# EAGLE schematic source_eagle (EAGLE 9.6.2)
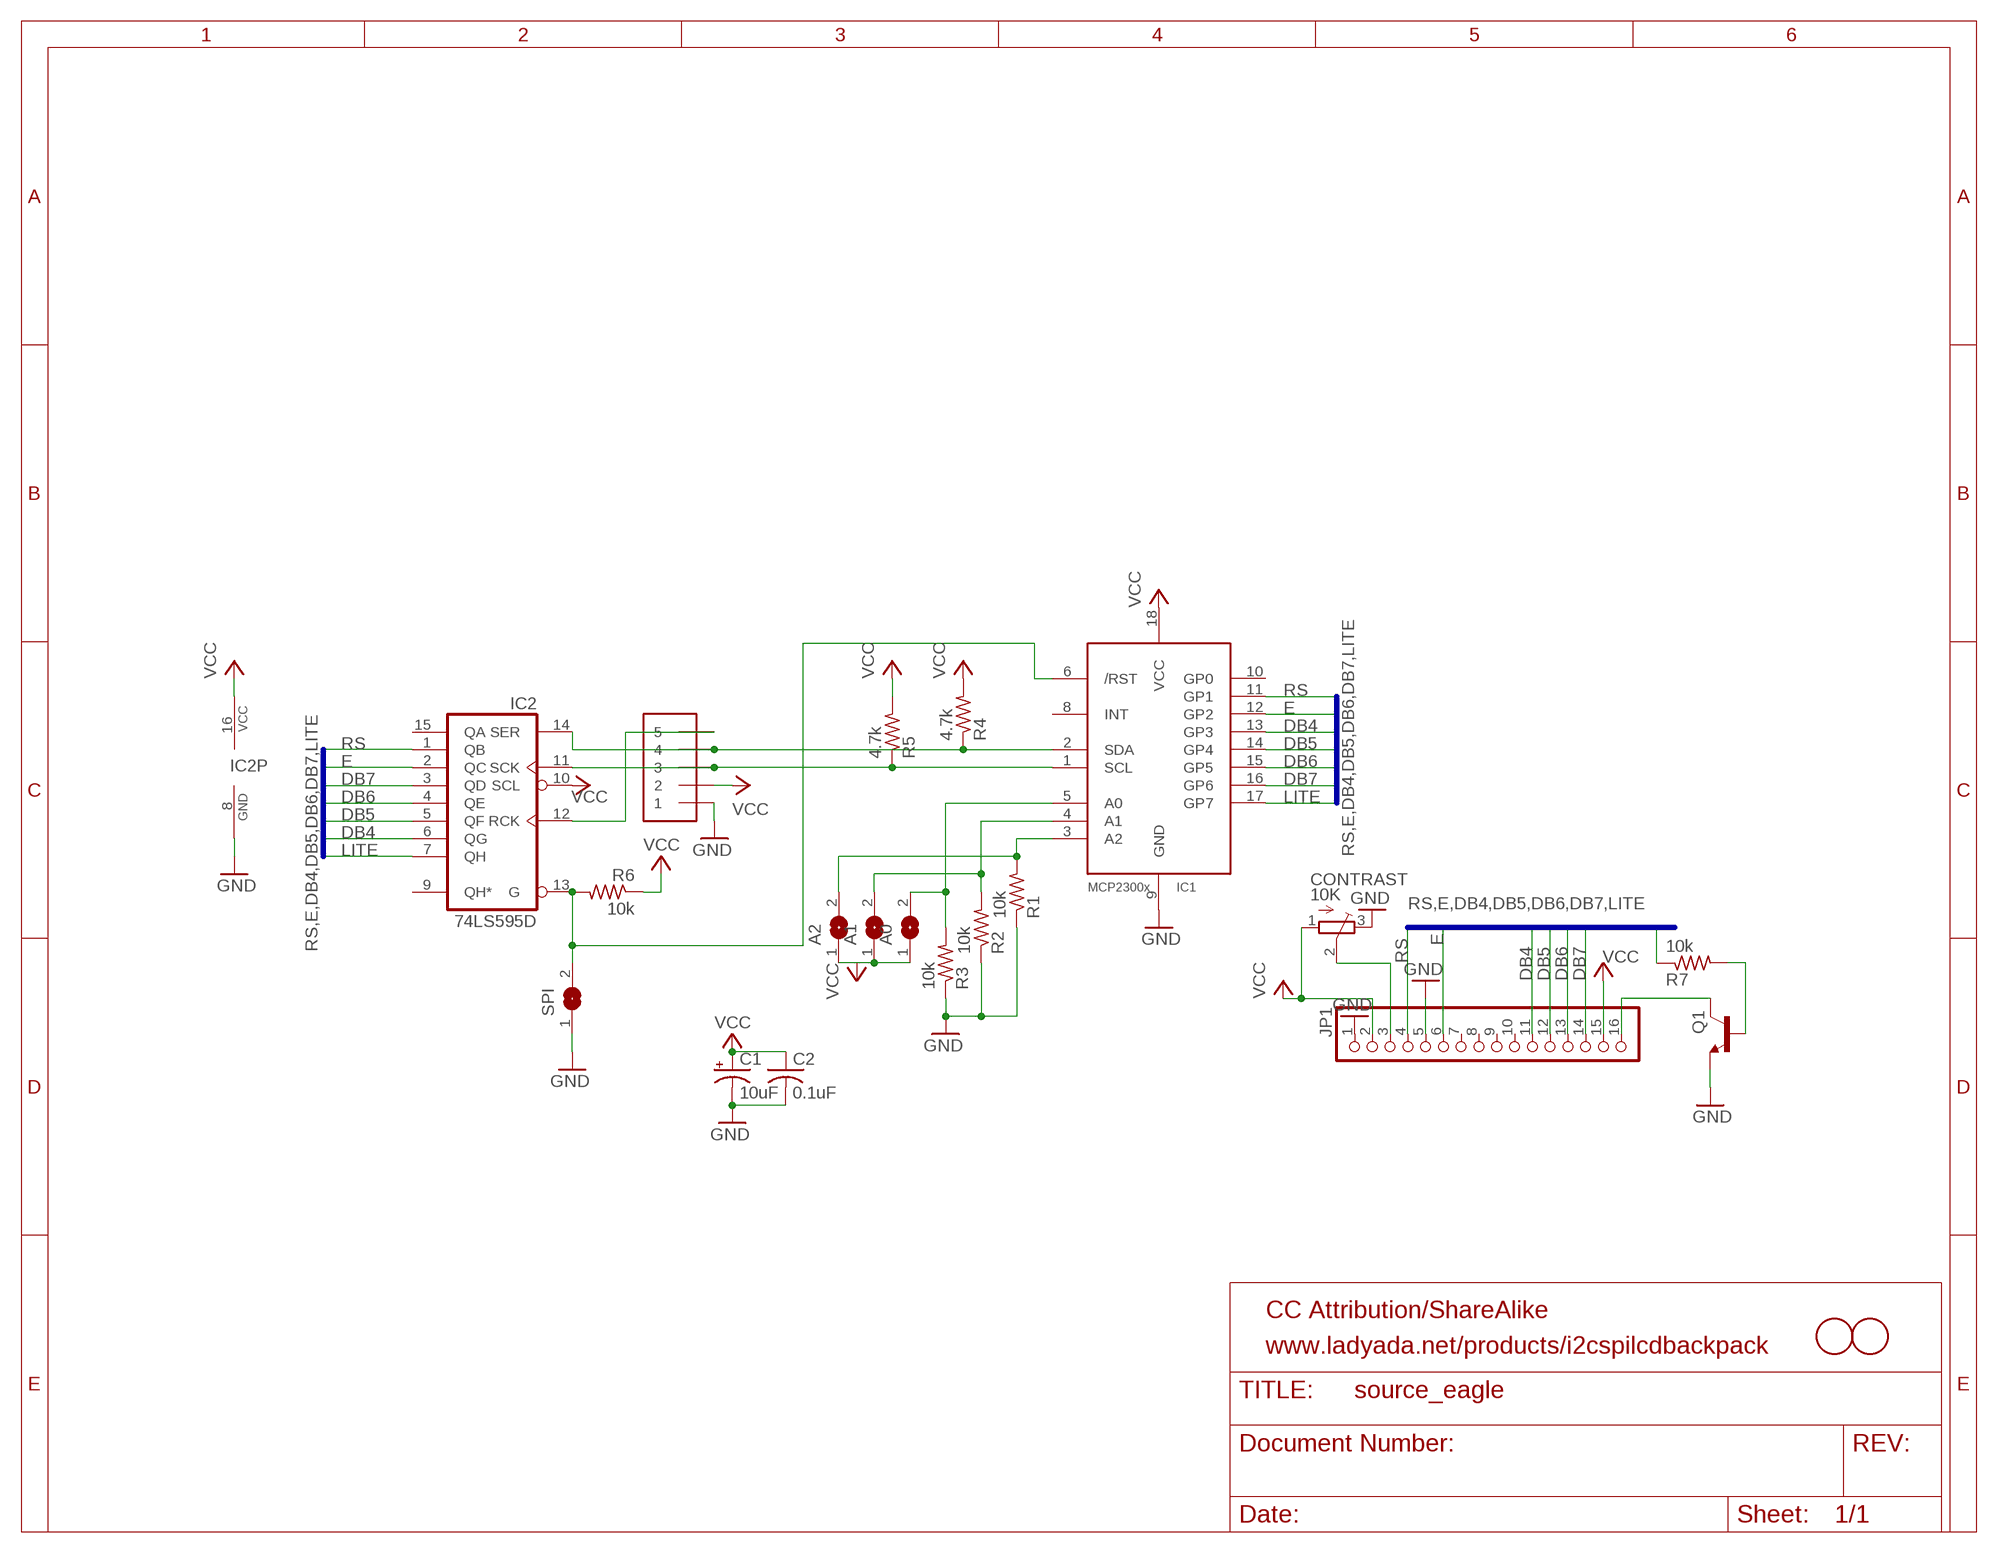
[diagram p0: schematic, sheet 1]

## Parts
A0  SJ  [SJ]
A1  SJ  [SJ]
A2  SJ  [SJ]
C1  10uF  CPOL-USA/3216-18R  [A/3216-18R]
C2  0.1uF  C-USC0805K  [C0805K]
CONTRAST  10K  TRIMPOTTC33X  [TC33X]
IC1  MCP2300X/SO  [SO18W]
IC2  74LS595D  [SO16]
J1  1X5  [3.5MM-5P]
JP1  PINHD-1X16  [1X16]
Q1  MMBT2222ALT1-NPN-SOT23-BEC  [SOT23-BEC]
R1  10k  R-US_R0805  [R0805]
R2  10k  R-US_R0805  [R0805]
R3  10k  R-US_R0805  [R0805]
R4  4.7k  R-US_R0805  [R0805]
R5  4.7k  R-US_R0805  [R0805]
R6  10k  R-US_R0805  [R0805]
R7  10k  R-US_R0805  [R0805]
SPI  SJ  [SJ]
U$1  FIDUCIAL  [FIDUCIAL_1MM]
U$2  FIDUCIAL  [FIDUCIAL_1MM]

## Nets
CLOCK: IC1.1(SCL) IC2.11(SCK) J1.3 R5.1
DATA: IC1.2(SDA) IC2.14(SER) J1.4 R4.1
DB4: IC1.13(GP3) IC2.6(QG) JP1.11
DB5: IC1.14(GP4) IC2.5(QF) JP1.12
DB6: IC1.15(GP5) IC2.4(QE) JP1.13
DB7: IC1.16(GP6) IC2.3(QD) JP1.14
E: IC1.12(GP2) IC2.2(QC) JP1.6
GND: C1.- C2.2 CONTRAST.3(E) IC1.9(GND) IC2.8(GND) J1.1 JP1.1 JP1.5 Q1.E R1.1 R2.1 R3.1 SPI.1
LATCH: IC2.12(RCK) J1.5
LITE: IC1.17(GP7) IC2.7(QH) R7.1
N$1: A0.2 IC1.5(A0) R3.2
N$2: A1.2 IC1.4(A1) R2.2
N$3: A2.2 IC1.3(A2) R1.2
N$6: IC1.6(/RST) IC2.13(G) R6.2 SPI.2
N$7: JP1.16 Q1.C
N$9: Q1.B R7.2
N$10: CONTRAST.2(S) JP1.3
RS: IC1.11(GP1) IC2.1(QB) JP1.4
VCC: A0.1 A1.1 A2.1 C1.+ C2.1 CONTRAST.1(A) IC1.18(VCC) IC2.10(SCL) IC2.16(VCC) J1.2 JP1.2 JP1.15 R4.2 R5.2 R6.1
Unconnected: IC1.8(INT) IC1.10(GP0) IC2.9(QH*) IC2.15(QA) JP1.7 JP1.8 JP1.9 JP1.10

## Buses
RS,E,DB4,DB5,DB6,DB7,LITE

## Notes on the sheet
- CC Attribution/ShareAlike
- www.ladyada.net/products/i2cspilcdbackpack

## Library data of the parts
A0 A1 A2 SPI = jumper:SJ: SMD solder JUMPER
C1 = adafruit:CPOL-US: POLARIZED CAPACITOR, American symbol
C2 = adafruit:C-US: CAPACITOR, American symbol
CONTRAST = adafruit:TRIMPOT: SMT trimmer potentiometer part number TC33X http://www.ladyada.net/library/eagle
IC1 = adafruit:MCP2300X: MCP23008 Inexpensive i2c i/o expander - 8 general purpose i/o pins with optional pullups
IC2 = 74xx-us:74*595: 8-bit SHIFT REGISTER, output latch
J1 = adafruit:1X5
JP1 = pinhead:PINHD-1X16: PIN HEADER
Q1 = transistor:*-NPN-: NPN Transistror BF959 corrected 2008.03.06
R1-R7 = adafruit:R-US_: RESISTOR, American symbol
U$1 U$2 = adafruit:FIDUCIAL: For use by pick and place machines to calibrate the vision/machine, 1mm By microbuilder.eu